# EAGLE design 118_hall (EAGLE 9.6.0)
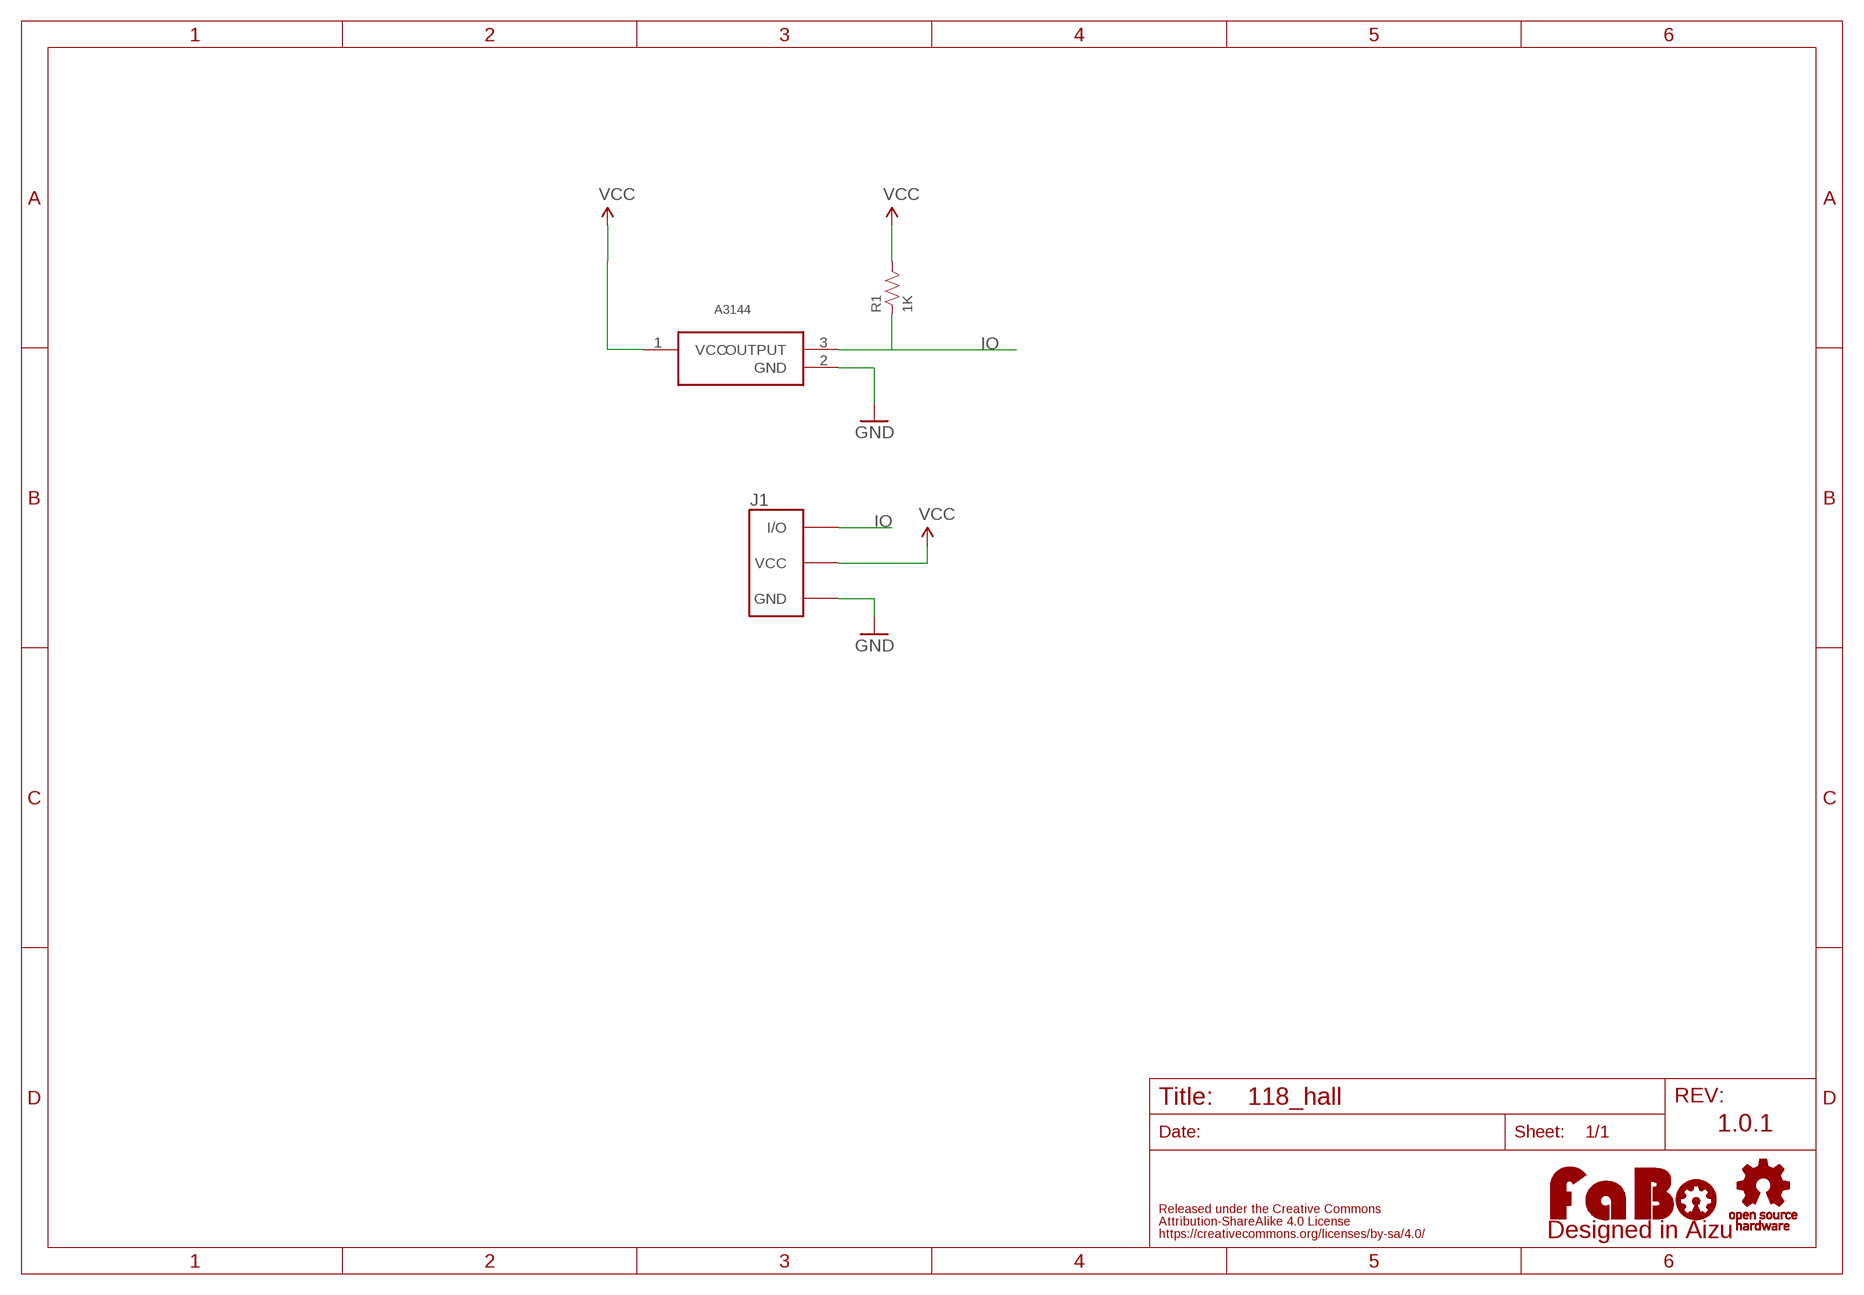
[diagram p0: schematic, sheet 1]

## Parts
A3144  A3144  [SOT-89]
J1  FABO_BRICK_3PIN  [FABO_BRICK_3PIN]
LOGO1  LOGO_FABO-M  [LOGO_FABO_M]
R1  1K  RESISTOR-0603  [0603]
U$2  LOGO_OSHW-M_BOTTOM  [LOGO_OSHW_M_BOTTOM]

## Nets
GND: A3144.2(GND) J1.GND
IO: A3144.3(OUTPUT) J1.I/O R1.1
VCC: A3144.1(VCC) J1.VCC R1.2

## Notes on the sheet
- 1.0.1

## Library data of the parts
A3144 = FaBo-Sensor:A3144
J1 = FaBo-Template:FABO_BRICK_3PIN: FaBo Brick 3pin
LOGO1 = component:LOGO_FABO
R1 = FaBo-Resistors:RESISTOR: RESISTOR
U$2 = FaBo-etc:LOGO_OSHW

## Board
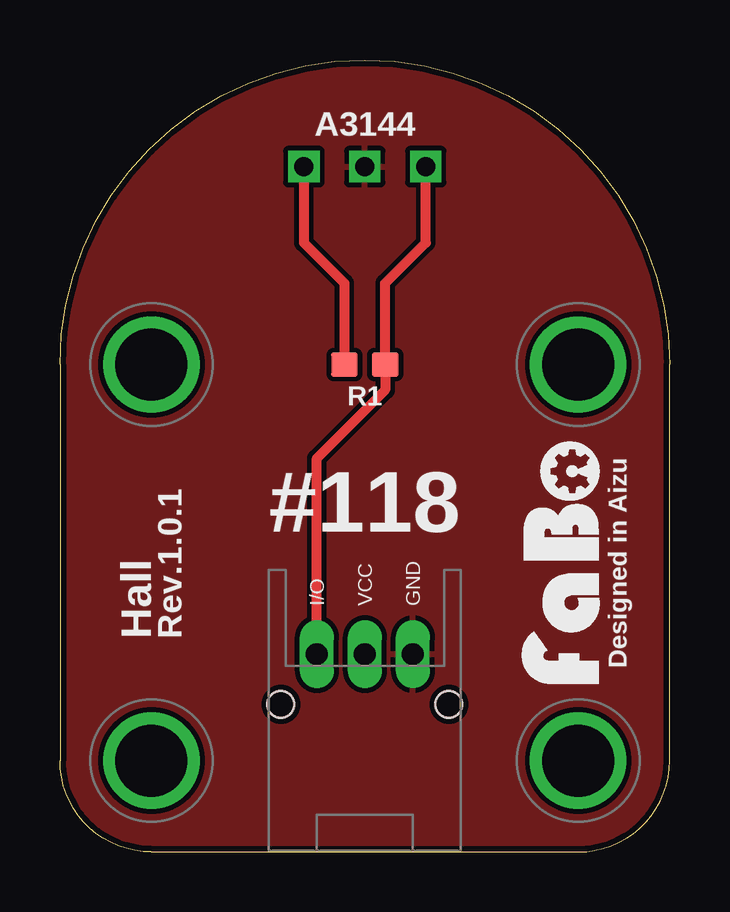
[diagram p1: board, top side]
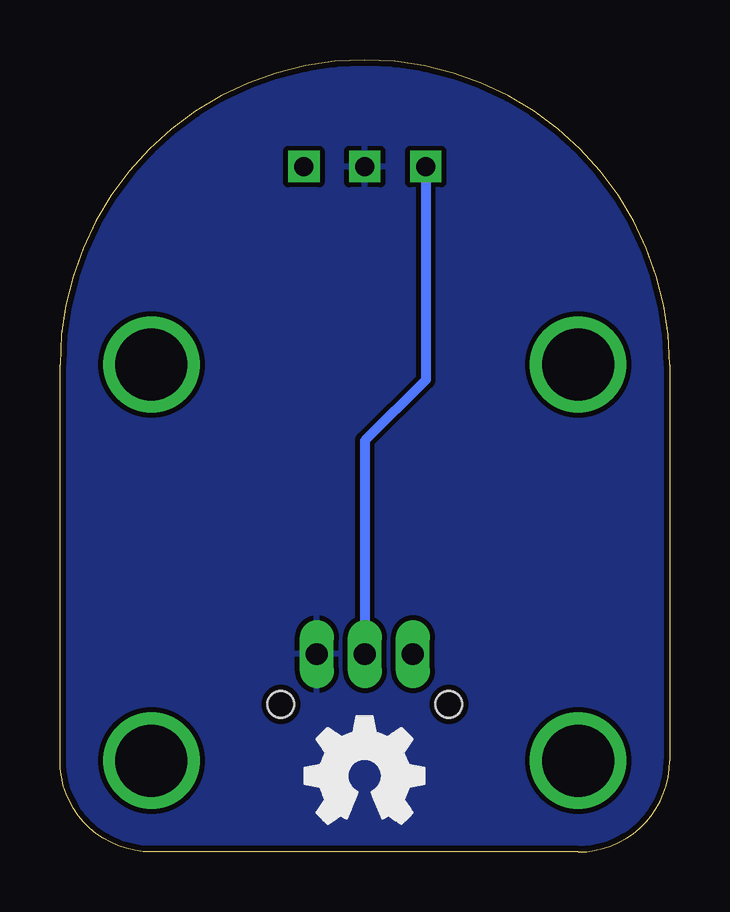
[diagram p2: board, bottom side, seen from below]

Size 25.4 x 33.02 mm. Coordinates in mm from the lower left corner, seen from the top.
Copper layers (1*16): Top 0.035mm / dielectric 1.6mm / Bottom 0.035mm
Design rules "PCBway": minimum track width 6mil, minimum drill 12mil, track to track 6mil, track to pad 6mil, pad to pad 6mil, via to via 6mil, smd to smd 6mil, copper to edge 10mil, drill to drill 10mil, minimum pad ring 10mil, minimum via ring 6mil, stop-mask expansion 2mil, vias tented up to drill 100mil, thermal gap 8mil

### Footprints (pad centres in the part's own frame; a part is rotated, then mirrored left to right if it is on the bottom)
SOT-89 = drill 0.8 square: 1 -2.54,0; 2 0,0; 3 2.54,0
FABO_BRICK_3PIN = drill 0.9 pad 1.422 long: GND 2,-8.255; I/O -2,-8.255; VCC 0,-8.255 | drill 3 pad 3.81: P$1 -8.89,3.81; P$2 8.89,3.81; P$3 -8.89,-12.7; P$4 8.89,-12.7 | hole 1.1: -3.5,-10.355; 3.5,-10.355
0603 = smd 1.1 x 1: 1 -0.85,0; 2 0.85,0

### Placement (x,y rotation side)
A3144  12.7,28.57 0 top
J1  12.7,16.51 0 top
LOGO1  22.86,12.06 90 top
R1  12.7,20.32 180 top
U$2  12.7,3.17 0 top

### Tracks (layer width: path | path; a pad name or v marks a point on that pad's centre or on a via)
GND
  pour Bottom (isolate 0.203): 0,0 25.4,0 25.4,33.02 0,33.02
  pour Top (isolate 0.203): 0,0 25.4,0 25.4,33.02 0,33.02
IO
  Top 0.406: J1.I/O 10.7,16.41 13.55,19.27 R1.1 13.55,23.71 15.24,25.4 A3144.3
VCC
  Top 0.406: R1.2 11.85,23.71 10.16,25.4 A3144.1
  Bottom 0.406: J1.VCC 12.7,17.14 10.16,19.68 A3144.1

### Text on the board
tPlace: #118 | Designed in Aizu | Hall | Rev.1.0.1